# Altium project wikiduino-atmega328p.PrjPCB
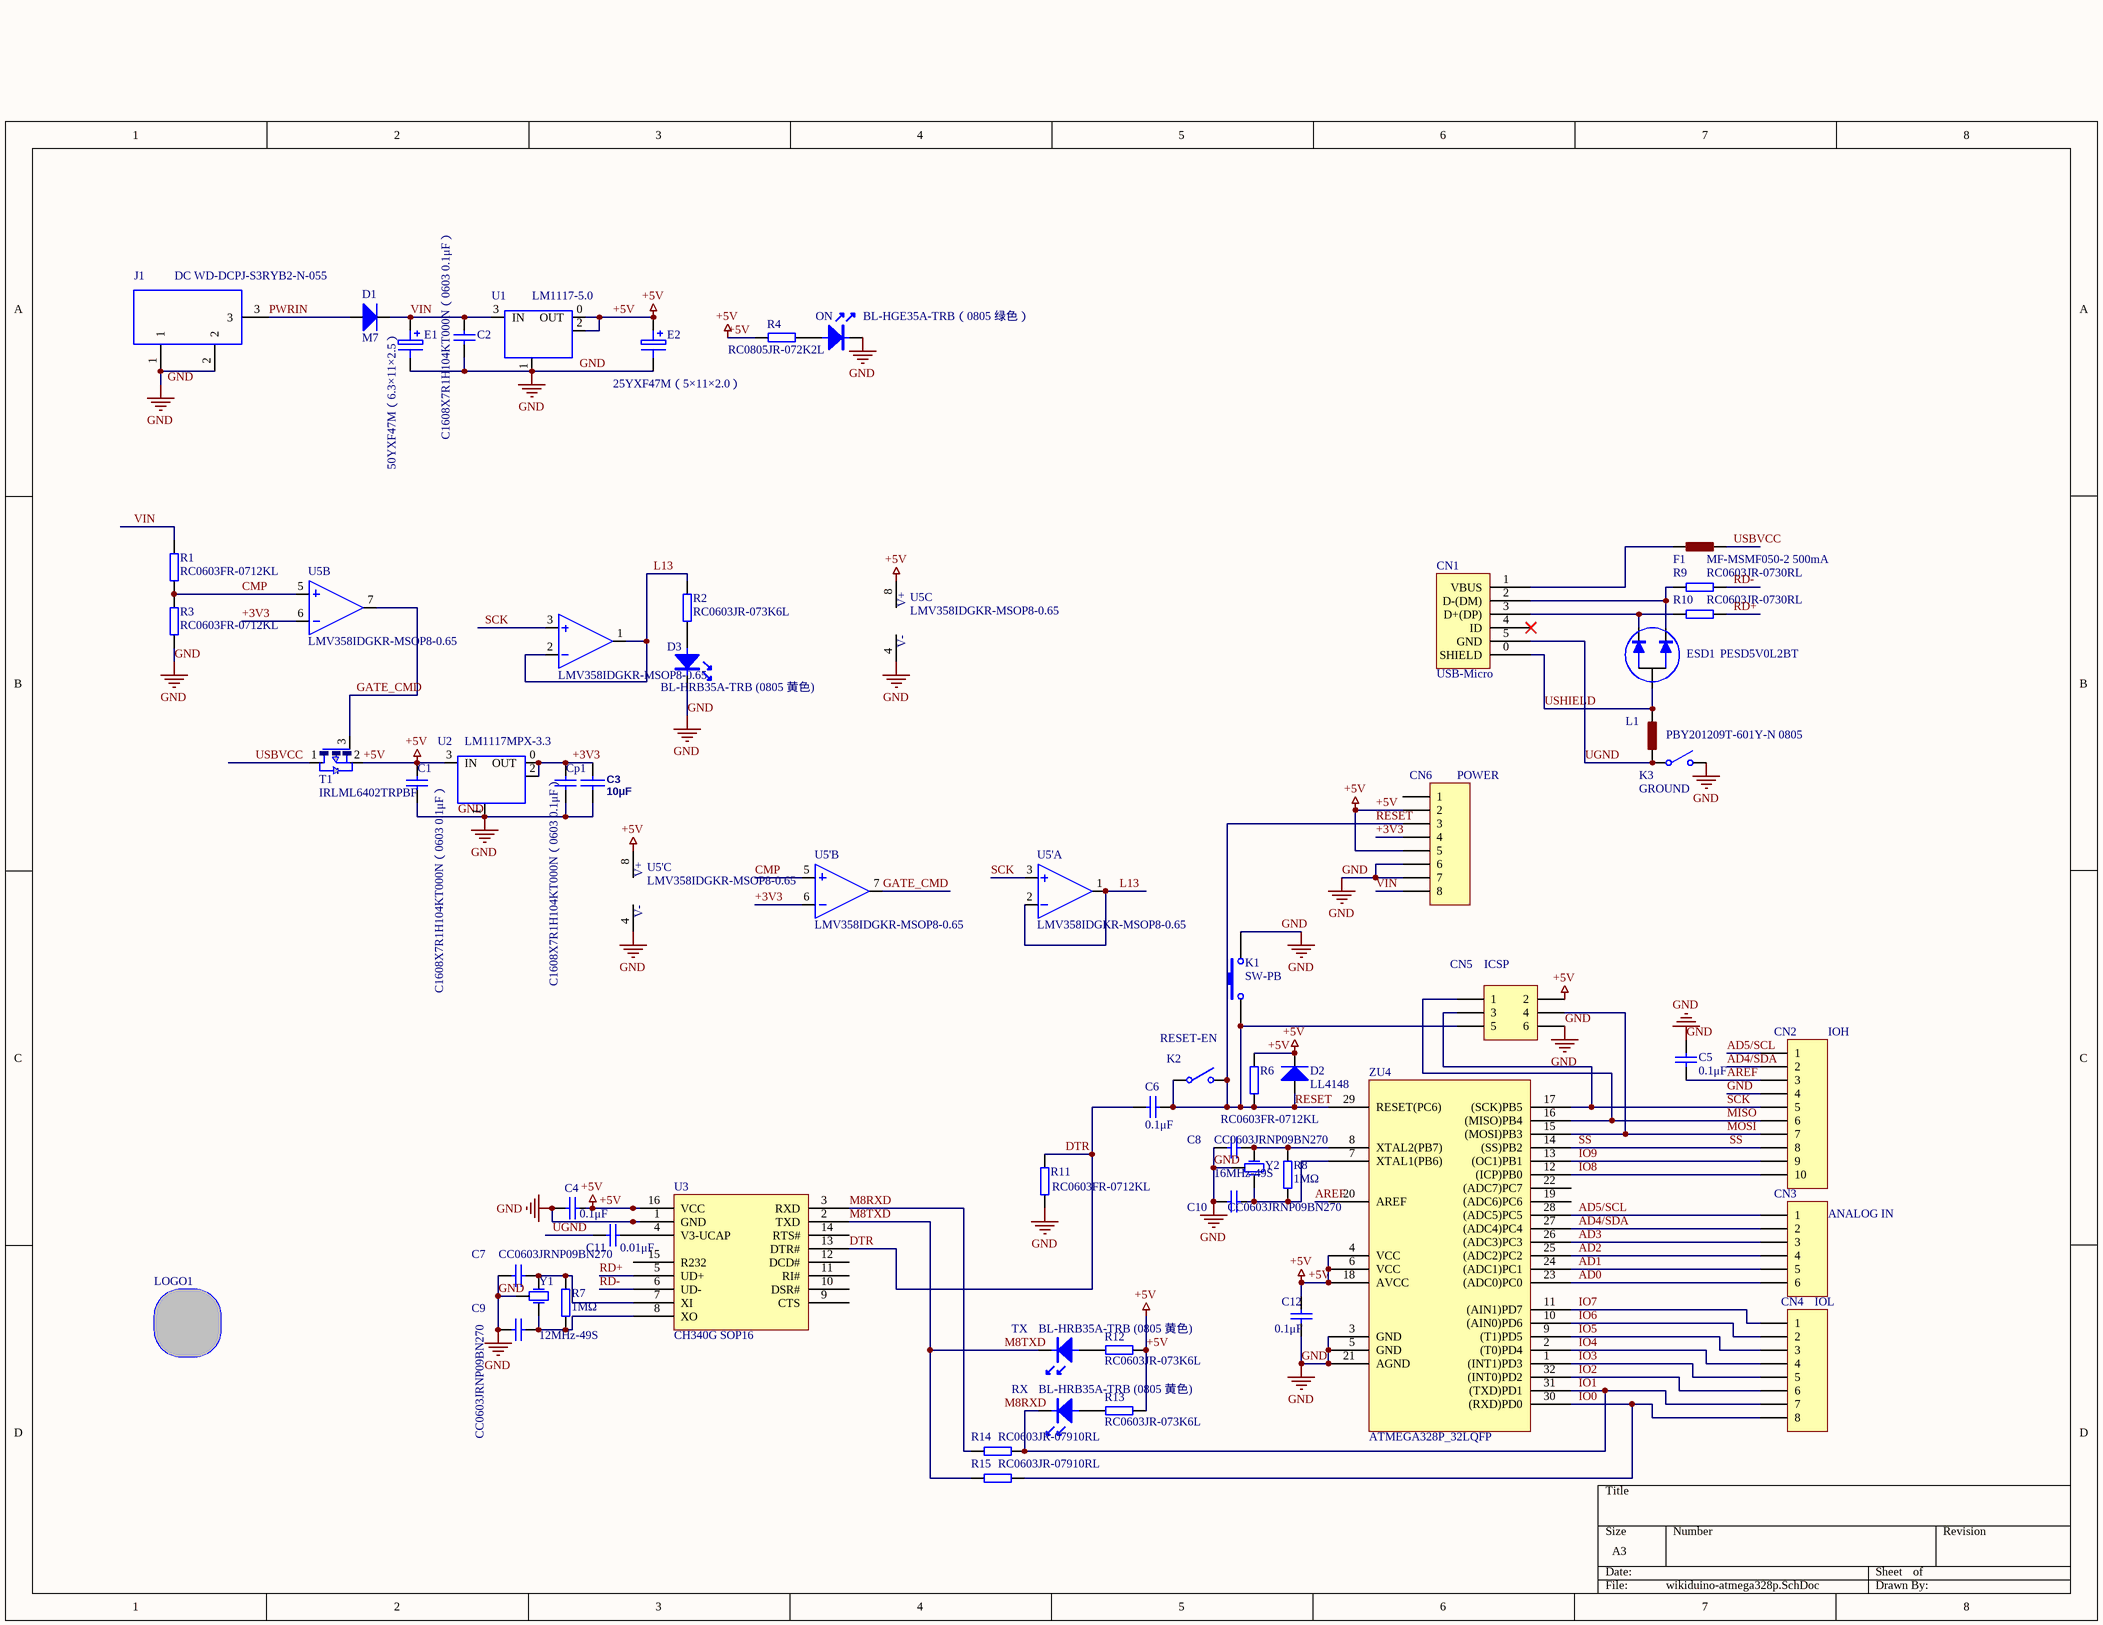
[diagram p0: wikiduino-atmega328p.SchDoc]
1 sheet, 58 parts. Net scope: global (net labels, ports and power ports of the same name join across sheets).
Board file: wikiduino-atmega328p.PcbDoc

## Sheet wikiduino-atmega328p.SchDoc
size A3

### Parts
C1  C1608X7R1H104KT000N（0603 0.1μF）  [0603C]
C2  C1608X7R1H104KT000N（0603 0.1μF）  [0603C]
C3  10μF  [1206C]
C4  0.1μF  [0603C]
C5  0.1μF  [0603C]
C6  0.1μF  [0603C]
C7  CC0603JRNP09BN270  [0603C]
C8  CC0603JRNP09BN270  [0603C]
C9  CC0603JRNP09BN270  [0603C]
C10  CC0603JRNP09BN270  [0603C]
C11  0.01μF  [0603C]
C12  0.1μF  [0603C]
CN1  USB-Micro  [USB_MICRO_5S_B]
CN2  IOH  [HDR1X10Z]
CN3  ANALOG IN  [HDR1X6Z]
CN4  IOL  [HDR1X8Z]
CN5  ICSP  [HDR2X3]
CN6  POWER  [HDR1X8Z]
Cp1  C1608X7R1H104KT000N（0603 0.1μF）  [0603C]
D1  M7  [M7]
D2  LL4148  [D1206]
D3  BL-HRB35A-TRB (0805 黄色)  [LED0805-Y]
E1  50YXF47M（6.3×11×2.5）  [RB 6.3×11×2.5]
E2  25YXF47M（5×11×2.0）  [RB 6.3×11×2.5]
ESD1  PESD5V0L2BT  [SOT-23]
F1  MF-MSMF050-2 500mA  [L1206]
J1  DC WD-DCPJ-S3RYB2-N-055  [DC_IN]
K1  SW-PB  [按钮/SO]
K2  RESET-EN  [0101]
K3  GROUND  [0101]
L1  PBY201209T-601Y-N 0805  [L0805]
LOGO1  LOGO  [USB_LOGO]  (value not drawn)
ON  BL-HGE35A-TRB（0805 绿色）  [LED0805-R]
R1  RC0603FR-0712KL  [0603R]
R2  RC0603JR-073K6L  [0603R]
R3  RC0603FR-0712KL  [0603R]
R4  RC0805JR-072K2L  [0805/R]
R6  RC0603FR-0712KL  [0603R]
R7  1MΩ  [0603R]
R8  1MΩ  [0603R]
R9  RC0603JR-0730RL  [0603R]
R10  RC0603JR-0730RL  [0603R]
R11  RC0603FR-0712KL  [0603R]
R12  RC0603JR-073K6L  [0603R]
R13  RC0603JR-073K6L  [0603R]
R14  RC0603JR-07910RL  [0603R]
R15  RC0603JR-07910RL  [0603R]
RX  BL-HRB35A-TRB (0805 黄色)  [LED0805-Y]
T1  IRLML6402TRPBF  [MOSFET]
TX  BL-HRB35A-TRB (0805 黄色)  [LED0805-Y]
U1  LM1117-5.0  [SOT223]
U2  LM1117MPX-3.3  [SOT223]
U3  CH340G SOP16  [SO-16]
U5  LMV358IDGKR-MSOP8-0.65  [MSOP8-0.65]  (parts A,B,C of 3)
U5'  LMV358IDGKR-MSOP8-0.65  (parts A,B,C of 3)
Y1  12MHz-49S  [XTAL-49S]
Y2  16MHz-49S  [XTAL-49S]
ZU4  ATMEGA328P_32LQFP  [LQFP32]

### Nets
+5V: C1.1 C4.2 C12.2 CN5.2 CN6.2 CN6.5 D2.K E2.1 R4.2 R6.1 R12.1 R13.1 T1.2(S) U1.0(OUT) U1.2(OUT@1) U2.3(IN) U3.16(VCC) U5.8(V+) U5'.8(V+) ZU4.4(VCC) ZU4.6(VCC) ZU4.18(AVCC)
GND: C1.2 C2.1 C3.1 C4.1 C5.2 C7.1 C8.1 C9.1 C10.1 C12.1 CN2.4 CN5.6 CN6.6 CN6.7 Cp1.2 D3.K E1.2 E2.2 J1.1 J1.2 K1.2 K3.2(NO) ON.K R3.2 R11.2 U1.1(GND/ADJ) U2.1(GND/ADJ) U3.1(GND) U5.4(V-) U5'.4(V-) Y1.3 Y2.3 ZU4.3(GND) ZU4.5(GND) ZU4.21(AGND)
+3V3: C3.2 CN6.4 Cp1.1 U2.0(OUT) U2.2(OUT@1) U5.6(-IN) U5'.6(-IN)
AD0: CN3.6 ZU4.23((ADC0)PC0)
AD1: CN3.5 ZU4.24((ADC1)PC1)
AD2: CN3.4 ZU4.25((ADC2)PC2)
AD3: CN3.3 ZU4.26((ADC3)PC3)
AD4/SDA: CN2.2 CN3.2 ZU4.27((ADC4)PC4)
AD5/SCL: CN2.1 CN3.1 ZU4.28((ADC5)PC5)
AREF: C5.1 CN2.3 ZU4.20(AREF)
CMP: R1.2 R3.1 U5.5(+IN) U5'.5(+IN)
DTR: C6.1 R11.1 U3.13(DTR#)
GATE_CMD: T1.3(G) U5.7(OUT) U5'.7(OUT)
IO0: CN4.8 R15.1 ZU4.30((RXD)PD0)
IO1: CN4.7 R14.1 RX.K ZU4.31((TXD)PD1)
IO2: CN4.6 ZU4.32((INT0)PD2)
IO3: CN4.5 ZU4.1((INT1)PD3)
IO4: CN4.4 ZU4.2((T0)PD4)
IO5: CN4.3 ZU4.9((T1)PD5)
IO6: CN4.2 ZU4.10((AIN0)PD6)
IO7: CN4.1 ZU4.11((AIN1)PD7)
IO8: CN2.10 ZU4.12((ICP)PB0)
IO9: CN2.9 ZU4.13((OC1)PB1)
L13: R2.1 U5.1(OUT) U5.2(-IN) U5'.1(OUT) U5'.2(-IN)
M8RXD: R14.2 U3.3(RXD)
M8TXD: R15.2 TX.K U3.2(TXD)
MISO: CN2.6 CN5.1 ZU4.16((MISO)PB4)
MOSI: CN2.7 CN5.4 ZU4.15((MOSI)PB3)
PWRIN: D1.A J1.3
RD+: R10.1 U3.5(UD+)
RD-: R9.1 U3.6(UD-)
RESET: C6.2 CN5.5 CN6.3 D2.A K1.1 K2.1(COMMON) K2.2(NO) R6.2 ZU4.29(RESET(PC6))
SCK: CN2.5 CN5.3 U5.3(+IN) U5'.3(+IN) ZU4.17((SCK)PB5)
SS: CN2.8 ZU4.14((SS)PB2)
UGND: C11.2 CN1.5(GND) K3.1(COMMON) L1.2
USBVCC: F1.1 T1.1(D)
USHIELD: CN1.0(SHIELD) ESD1.3 L1.1
VIN: C2.2 CN6.8 D1.K E1.1 R1.1 U1.3(IN)
NetC7_2: C7.2 R7.1 U3.7(XI) Y1.1(OSC1)
NetC8_2: C8.2 R8.1 Y2.1(OSC1) ZU4.8(XTAL2(PB7))
NetC9_2: C9.2 R7.2 U3.8(XO) Y1.2(OSC2)
NetC10_2: C10.2 R8.2 Y2.2(OSC2) ZU4.7(XTAL1(PB6))
NetC11_1: C11.1 U3.4(V3-UCAP)
NetCN1_1: CN1.1(VBUS) F1.2
NetCN1_2: CN1.2(D-(DM)) ESD1.2 R9.2
NetCN1_3: CN1.3(D+(DP)) ESD1.1 R10.2
NetD3_A: D3.A R2.2
NetON_A: ON.A R4.1
NetR12_2: R12.2 TX.A
NetR13_2: R13.2 RX.A

Not connected (* = marked no-connect by the designer): CN1 4(ID)*; CN6 1; U3 9(CTS) 10(DSR#) 11(RI#) 12(DCD#) 14(RTS#) 15(R232); ZU4 19((ADC6)PC6) 22((ADC7)PC7)

### Notes on the sheet
- Labels drawn without touching a wire or pin: GND, M8RXD

### Library data of the parts
C1 Cp1 = Cap: Capacitor; Value: 100pF; Published: 8-Jun-2000; LatestRevisionDate: 17-Jul-2002; LatestRevisionNote: Re-released for DXP Platform.; PackageReference: RAD-0.3; Publisher: Altium Limited; PackageDescription: Radial Cap, Thru-Hole; 2 Leads; 0.3 in Pin Spacing
C2 C4-C12 = Cap: Capacitor; Published: 8-Jun-2000; LatestRevisionDate: 17-Jul-2002; LatestRevisionNote: Re-released for DXP Platform.; PackageReference: RAD-0.3; Publisher: Altium Limited; PackageDescription: Radial Cap, Thru-Hole; 2 Leads; 0.3 in Pin Spacing
C3 = CAP: Capacitor
CN2 = Header 10: Header, 10-Pin; LatestRevisionDate: 17-Jul-2002; LatestRevisionNote: Re-released for DXP Platform.; Publisher: Altium Limited
CN3 = Header 6: Header, 6-Pin; LatestRevisionDate: 17-Jul-2002; LatestRevisionNote: Re-released for DXP Platform.; Publisher: Altium Limited
CN4 CN6 = Header 8: Header, 8-Pin; LatestRevisionDate: 17-Jul-2002; LatestRevisionNote: Re-released for DXP Platform.; Publisher: Altium Limited
CN5 = Header 3X2: Header, 3-Pin, Dual row; LatestRevisionDate: 17-Jul-2002; LatestRevisionNote: Re-released for DXP Platform.; Publisher: Altium Limited
D1 D2 = M7: D
D3 ON RX TX = LED
E1 E2 = E
ESD1 = ESD1
F1 L1 = L: BLM21
J1 = DC_IN: POWERSUPPLY_DC21MMX
K1 = SW-PB: Switch; Published: 24-Mar-1999; LatestRevisionDate: 17-Jul-2002; LatestRevisionNote: Re-released for DXP Platform.; PackageReference: SPST-2; Publisher: Altium Limited; PackageDescription: Switch; 2 Leads
K2 K3 = SW-SPST: Single-Pole, Single-Throw Switch; Published: 24-Mar-1999; LatestRevisionDate: 17-Jul-2002; LatestRevisionNote: Re-released for DXP Platform.; PackageReference: SPST-2; Publisher: Altium Limited; PackageDescription: Switch; 2 Leads
R1-R4 R6-R15 = R: Resistor
T1 = PMOSSOT23
U1 U2 = LM1117
U3 = CH340G
U5 U5' = LMV358MMX
Y1 Y2 = XTAL1: 3pXTAL
ZU4 = ATMEGA328P_32LQFP: Arduino ATMEGA328P